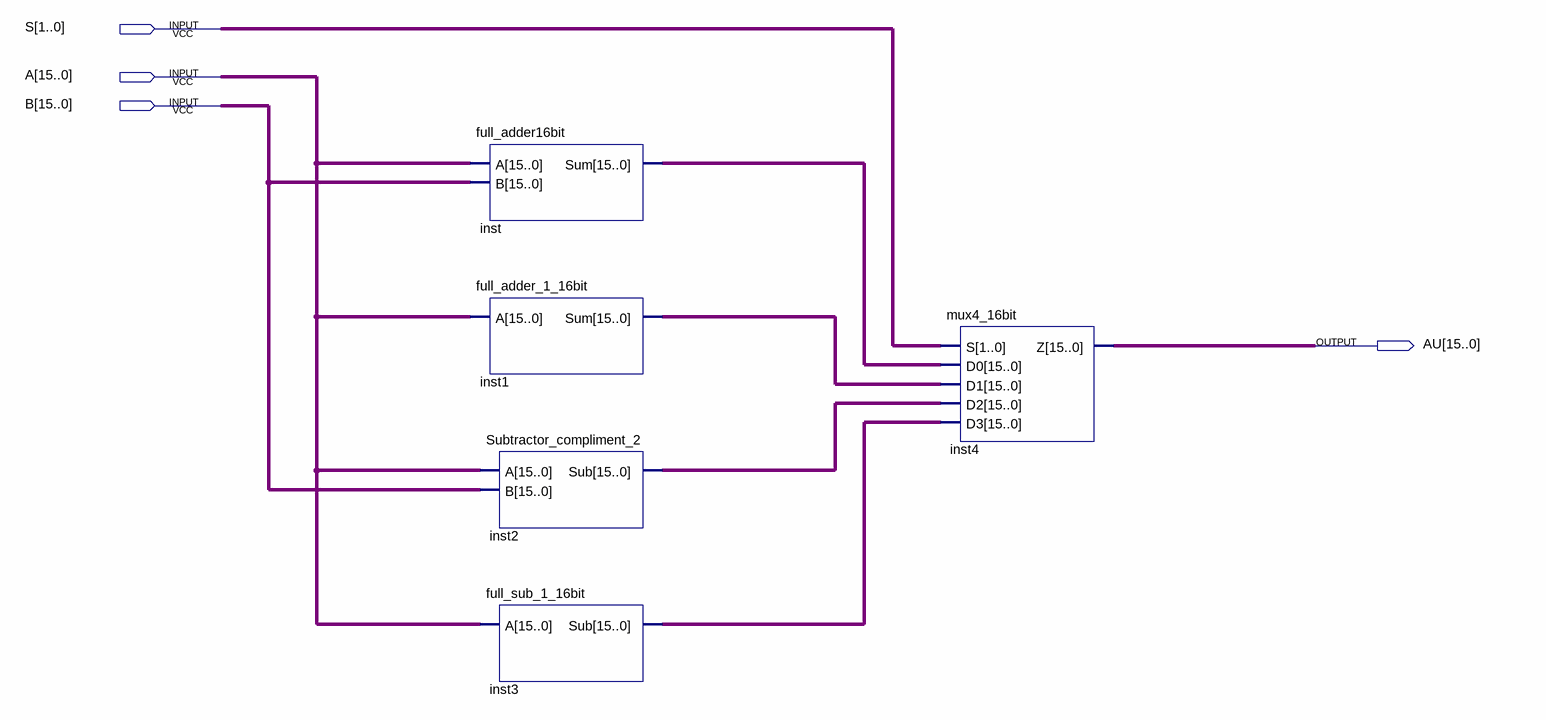
[diagram p0: schematic sheet]
// Quartus schematic AU_16bit.bdf as structural Verilog: 5 symbols, 4 pins
module AU_16bit (
  input  [1:0] S,
  input  [15:0] A,
  input  [15:0] B,
  output [15:0] AU
);

  wire [15:0] inst1_sum, inst2_sub, inst3_sub, inst_sum;

  full_adder16bit inst (.A(A), .B(B), .Sum(inst_sum));
  full_adder_1_16bit inst1 (.A(A), .Sum(inst1_sum));
  Subtractor_compliment_2 inst2 (.A(A), .B(B), .Sub(inst2_sub));
  full_sub_1_16bit inst3 (.A(A), .Sub(inst3_sub));
  mux4_16bit inst4 (.S(S), .D0(inst_sum), .D1(inst1_sum), .D2(inst2_sub), .D3(inst3_sub), .Z(AU));
endmodule
